# Altium project RTLS_Tag.PrjPcb
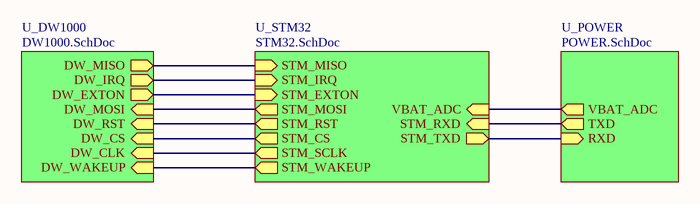
[diagram p0: TAG.SchDoc]
4 sheets, 76 parts. Net scope: hierarchical (ports join the sheet entries above them; power ports are global).
Board file: Tag_PCB.PcbDoc
Sheets:
  TAG.SchDoc
    U_DW1000 = DW1000.SchDoc
    U_POWER = POWER.SchDoc
    U_STM32 = STM32.SchDoc

## Sheet TAG.SchDoc
size A

### Sub-sheets
U_DW1000 = DW1000.SchDoc: DW_MOSI (in), DW_CS (in), DW_EXTON (out), DW_IRQ (out), DW_RST (in), DW_CLK (in), DW_MISO (out), DW_WAKEUP (in)
U_POWER = POWER.SchDoc: VBAT_ADC (out), TXD (out), RXD (in)
U_STM32 = STM32.SchDoc: STM_CS (out), STM_SCLK (out), STM_MISO (in), STM_MOSI (out), STM_WAKEUP (out), STM_IRQ (in), STM_EXTON (in), STM_RST (out), STM_TXD (out), STM_RXD (in), VBAT_ADC (in)

### Nets
DW_NRST: sheet U_DW1000/DW_RST, sheet U_STM32/STM_RST
EXTON: sheet U_DW1000/DW_EXTON, sheet U_STM32/STM_EXTON
IRQ: sheet U_DW1000/DW_IRQ, sheet U_STM32/STM_IRQ
SPI1_CLK: sheet U_DW1000/DW_CLK, sheet U_STM32/STM_SCLK
SPI1_CS: sheet U_DW1000/DW_CS, sheet U_STM32/STM_CS
SPI1_MISO: sheet U_DW1000/DW_MISO, sheet U_STM32/STM_MISO
SPI1_MOSI: sheet U_DW1000/DW_MOSI, sheet U_STM32/STM_MOSI
UART1_RXD: sheet U_POWER/RXD, sheet U_STM32/STM_TXD
UART1_TXD: sheet U_POWER/TXD, sheet U_STM32/STM_RXD
VBAT_ADC: sheet U_POWER/VBAT_ADC, sheet U_STM32/VBAT_ADC
WAKEUP: sheet U_DW1000/DW_WAKEUP, sheet U_STM32/STM_WAKEUP

## Sheet DW1000.SchDoc
size A
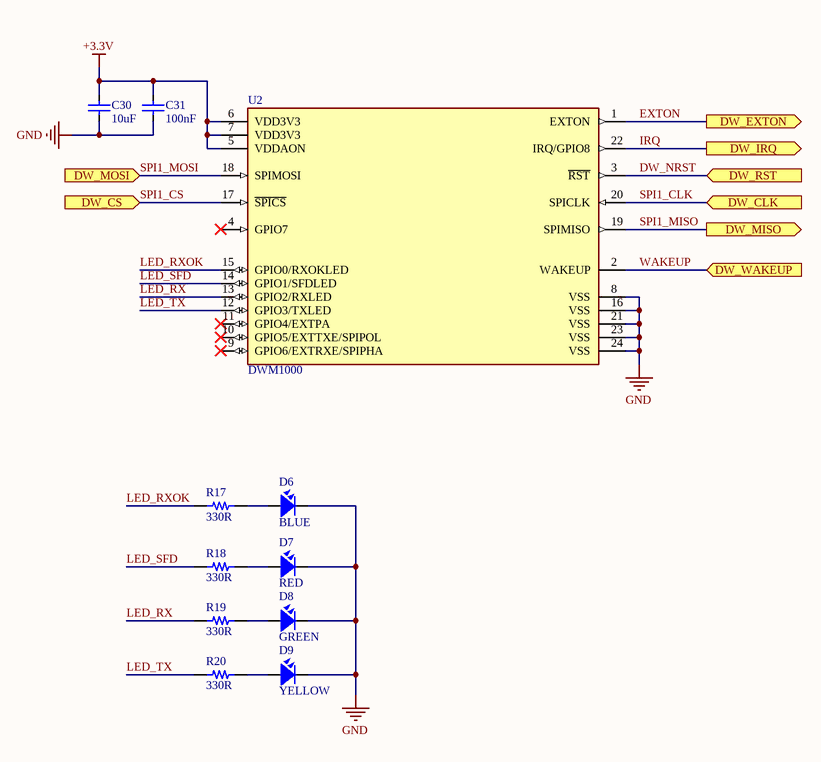
[diagram p1: DW1000.SchDoc]

### Parts
C30  10uF  [CAP_0603]
C31  100nF  [CAP_0603]
D6  BLUE  [LED-0603-Green]
D7  RED  [LED-0603-Red]
D8  GREEN  [LED-0603-Green]
D9  YELLOW  [LED-0603-Green]
R17  330R  [RES-SMD-0603]
R18  330R  [RES-SMD-0603]
R19  330R  [RES-SMD-0603]
R20  330R  [RES-SMD-0603]
U2  DWM1000  [DW1000]

### Ports
DW_CLK (in), DW_CS (in), DW_EXTON (out), DW_IRQ (out), DW_MISO (out), DW_MOSI (in), DW_RST (in), DW_WAKEUP (in)

### Nets
+3.3V: C30.2 C31.2 U2.5(VDDAON) U2.6(VDD3V3) U2.7(VDD3V3)
GND: C30.1 C31.1 D6.2 D7.2 D8.2 D9.2 U2.8(VSS) U2.16(VSS) U2.21(VSS) U2.23(VSS) U2.24(VSS)
DW_NRST: U2.3(~{RST}) ; port DW_RST
EXTON: U2.1(EXTON) ; port DW_EXTON
IRQ: U2.22(IRQ/GPIO8) ; port DW_IRQ
LED_RX: R19.2 U2.13(GPIO2/RXLED)
LED_RXOK: R17.2 U2.15(GPIO0/RXOKLED)
LED_SFD: R18.2 U2.14(GPIO1/SFDLED)
LED_TX: R20.2 U2.12(GPIO3/TXLED)
SPI1_CLK: U2.20(SPICLK) ; port DW_CLK
SPI1_CS: U2.17(~{SPICS}) ; port DW_CS
SPI1_MISO: U2.19(SPIMISO) ; port DW_MISO
SPI1_MOSI: U2.18(SPIMOSI) ; port DW_MOSI
WAKEUP: U2.2(WAKEUP) ; port DW_WAKEUP
NetD6_1: D6.1 R17.1
NetD7_1: D7.1 R18.1
NetD8_1: D8.1 R19.1
NetD9_1: D9.1 R20.1

Not connected (* = marked no-connect by the designer): U2 4(GPIO7)* 9(GPIO6/EXTRXE/SPIPHA)* 10(GPIO5/EXTTXE/SPIPOL)* 11(GPIO4/EXTPA)*

### Library data of the parts
C30 C31 = CapSMD: Capacitor; Value: 33p; Published: 8-Jun-2000; LatestRevisionDate: 17-Jul-2002; LatestRevisionNote: Re-released for DXP Platform.; PackageReference: RAD-0.3; Publisher: Altium Limited
D6-D9 = LED: LED Single colour Green and Red; Value: LED 3 ly Single Colour
R17-R20 = Resistor - SMD: Resistor; Manufacturer: Generic Components; Class: Passive; Published: 08/06/2000; Publisher: Altium Hobart Technology Centre
U2 = DWM1000: Decawave's DW1000 Ultra / Wideband (UWB) transceiver IC

## Sheet POWER.SchDoc
size A4
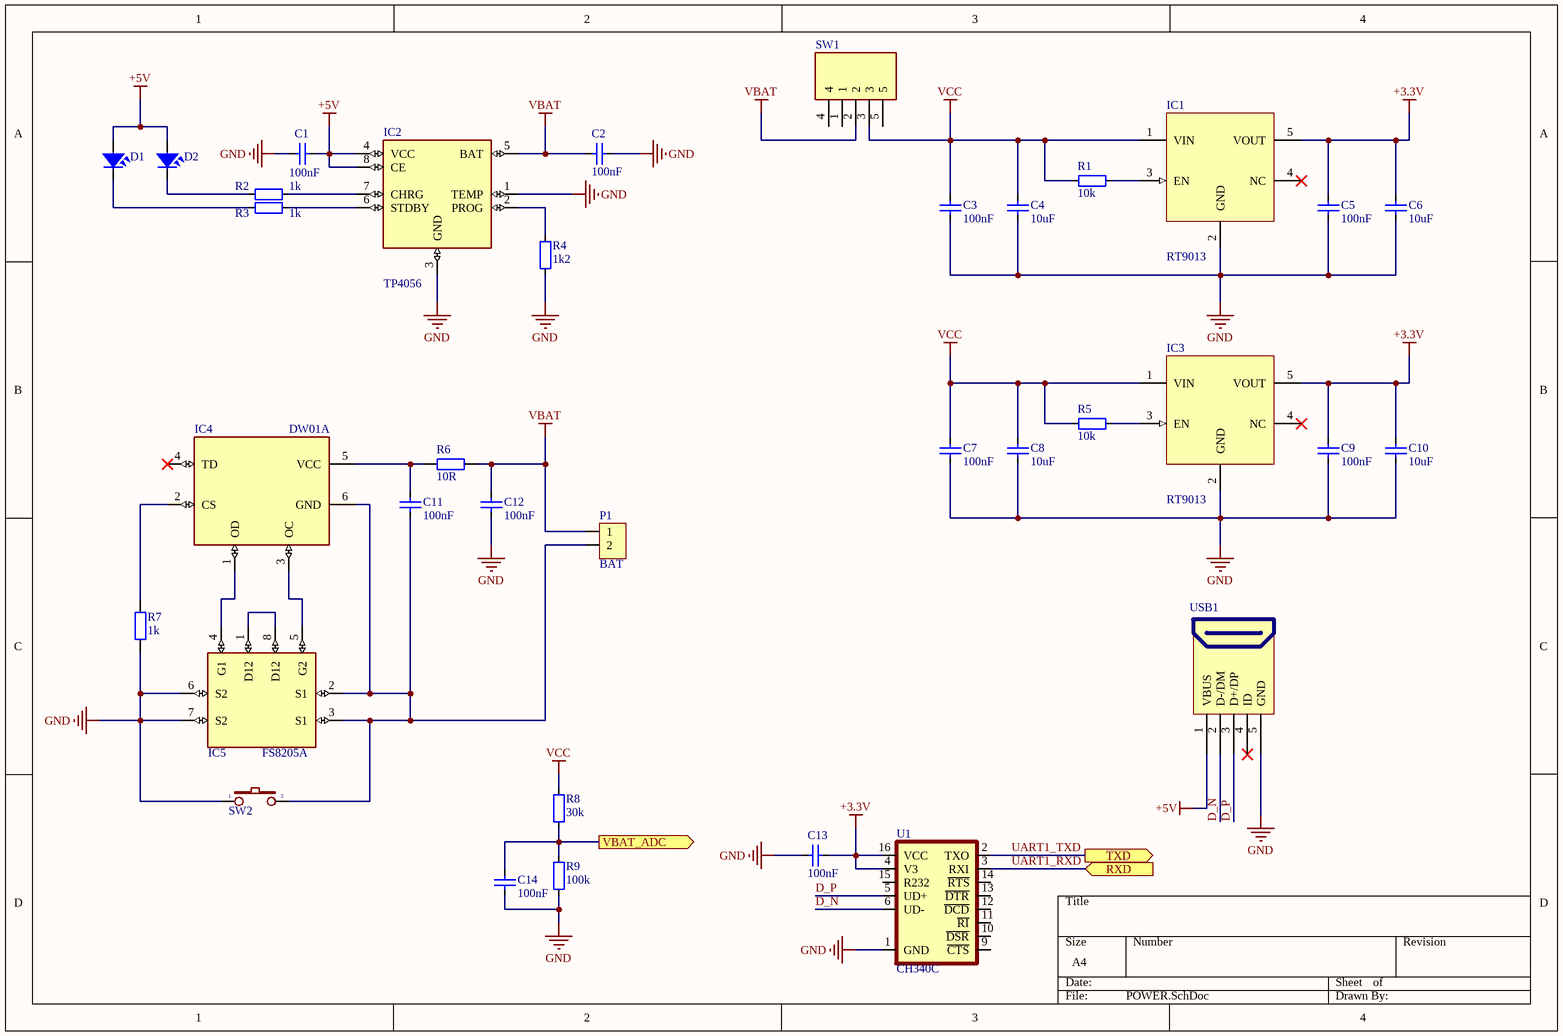
[diagram p2: POWER.SchDoc]

### Parts
C1  100nF  [CAP_0603]
C2  100nF  [CAP_0603]
C3  100nF  [CAP_0603]
C4  10uF  [CAP_0603]
C5  100nF  [CAP_0603]
C6  10uF  [CAP_0603]
C7  100nF  [CAP_0603]
C8  10uF  [CAP_0603]
C9  100nF  [CAP_0603]
C10  10uF  [CAP_0603]
C11  100nF  [CAP_0603]
C12  100nF  [CAP_0603]
C13  100nF  [CAP_0603]
C14  100nF  [CAP_0603]
D1  BLUE  [LED-0603-Green]  (value not drawn)
D2  BLUE  [LED-0603-Green]  (value not drawn)
IC1  RT9013  [SOT23-5]
IC2  TP4056  [TP4056]
IC3  RT9013  [SOT23-5]
IC4  DW01A  [SOT23-6]
IC5  FS8205A  [FS8205A]
P1  BAT  [HEAD2P-1.25]
R1  10k  [RES-SMD-0603]
R2  1k  [RES-SMD-0603]
R3  1k  [RES-SMD-0603]
R4  1k2  [RES-SMD-0603]
R5  10k  [RES-SMD-0603]
R6  10R  [RES-SMD-0603]
R7  1k  [RES-SMD-0603]
R8  30k  [RES-SMD-0603]
R9  100k  [RES-SMD-0603]
SW1  Cong tac gat  [CONG-TAC-GAT]  (value not drawn)
SW2  SW  [SW]  (value not drawn)
U1  CH340C  [SO16]
USB1  USB Micro 5p DIP  [USB Micro 5p DIP]  (value not drawn)

### Ports
RXD (in), TXD (out), VBAT_ADC (out)

### Nets
+3.3V: C5.1 C6.1 C9.1 C10.1 C13.1 IC1.5(VOUT) IC3.5(VOUT) U1.4(V3) U1.16(VCC)
+5V: C1.1 D1.1 D2.1 IC2.4(VCC) IC2.8(CE) USB1.1(VBUS)
GND: C1.2 C2.1 C3.2 C4.2 C5.2 C6.2 C7.2 C8.2 C9.2 C10.2 C12.1 C13.2 C14.1 IC1.2(GND) IC2.1(TEMP) IC2.3(GND) IC3.2(GND) IC5.6(S2) IC5.7(S2) R4.1 R7.2 R9.2 SW2.1 U1.1(GND) USB1.5(GND)
VBAT: C2.2 C12.2 IC2.5(BAT) P1.1 R6.2 SW1.2
VCC: C3.1 C4.1 C7.1 C8.1 IC1.1(VIN) IC3.1(VIN) R1.2 R5.2 R8.1 SW1.3
D_N: U1.6(UD-) USB1.2(D-/DM)
D_P: U1.5(UD+) USB1.3(D+/DP)
UART1_RXD: U1.3(RXI) ; port RXD
UART1_TXD: U1.2(TXO) ; port TXD
VBAT_ADC: C14.2 R8.2 R9.1 ; port VBAT_ADC
NetC11_1: C11.1 IC4.6(GND) IC5.2(S1) IC5.3(S1) P1.2 SW2.2
NetC11_2: C11.2 IC4.5(VCC) R6.1
NetD1_2: D1.2 R3.2
NetD2_2: D2.2 R2.2
NetIC1_3: IC1.3(EN) R1.1
NetIC2_2: IC2.2(PROG) R4.2
NetIC2_6: IC2.6(STDBY) R3.1
NetIC2_7: IC2.7(CHRG) R2.1
NetIC3_3: IC3.3(EN) R5.1
NetIC4_1: IC4.1(OD) IC5.4(G1)
NetIC4_2: IC4.2(CS) R7.1
NetIC4_3: IC4.3(OC) IC5.5(G2)
NetIC5_1: IC5.1(D12) IC5.8(D12)

Not connected (* = marked no-connect by the designer): IC1 4(NC)*; IC3 4(NC)*; IC4 4(TD)*; SW1 1 4 5; U1 9(~{CTS}) 10(~{DSR}) 11(~{RI}) 12(~{DCD}) 13(~{DTR}) 14(~{RTS}) 15(R232); USB1 4(ID)*

### Library data of the parts
C1-C14 = CapSMD: Capacitor; Value: 33p; Published: 8-Jun-2000; LatestRevisionDate: 17-Jul-2002; LatestRevisionNote: Re-released for DXP Platform.; PackageReference: RAD-0.3; Publisher: Altium Limited
D1 D2 = LED: as D6 on sheet DW1000
IC1 IC3 = RT9013: RT9013-33GB IC REG LINEAR 3.3V 500mA SOT23-5
IC2 = TP4056: Complete single cell Li-Ion battery with a constant current / constant voltage linear charger
IC4 = DW01A: One Cell Lithium-ion/Polymer Battery Protection IC
P1 = Header2: Header IDC, 2 x 1 Pin Vertical 2.54mm Pitch (Non-Boxed, Male); Manufacturer: W¨¹rth Elektronik eiSos GmbH; partNo: 613002143121; ComponentLink1 Description: Manufacturer; ComponentLink2 Description: Datasheet; NoPins: 02; Created Date: 29 March 2013; ComponentLink1URL: http://www.we-online.com; ComponentLink2URL: http://katalog.we-online.de/em/datasheet/6130xx143121.pdf; Created by: Karrer Zheng
R1-R5 R8 R9 = Resistor - SMD: as R17 on sheet DW1000; Published: 08/06/2000; Publisher: Altium Hobart Technology Centre
R6 R7 = Resistor - SMD: Resistor SMD; Manufacturer: Generic Components; Class: Passive; Published: 08/06/2000; Publisher: Altium Hobart Technology Centre
U1 = CH340C: USB to serial chip CH340; MF: WCH; Package: Package; Check_prices: https://www.snapeda.com/parts/CH340C/WCH/view-part/5428851/?ref=eda; Value: *; Price: None; MP: CH340C; Availability: Unavailable; SnapEDA_Link: https://www.snapeda.com/parts/CH340C/WCH/view-part/5428851/?ref=snap
USB1 = USB Micro 5p DIP: USB Type B; Ten: MicroUSB MK5P DIP; Ma_Hang: MH005145

## Sheet STM32.SchDoc
size A4
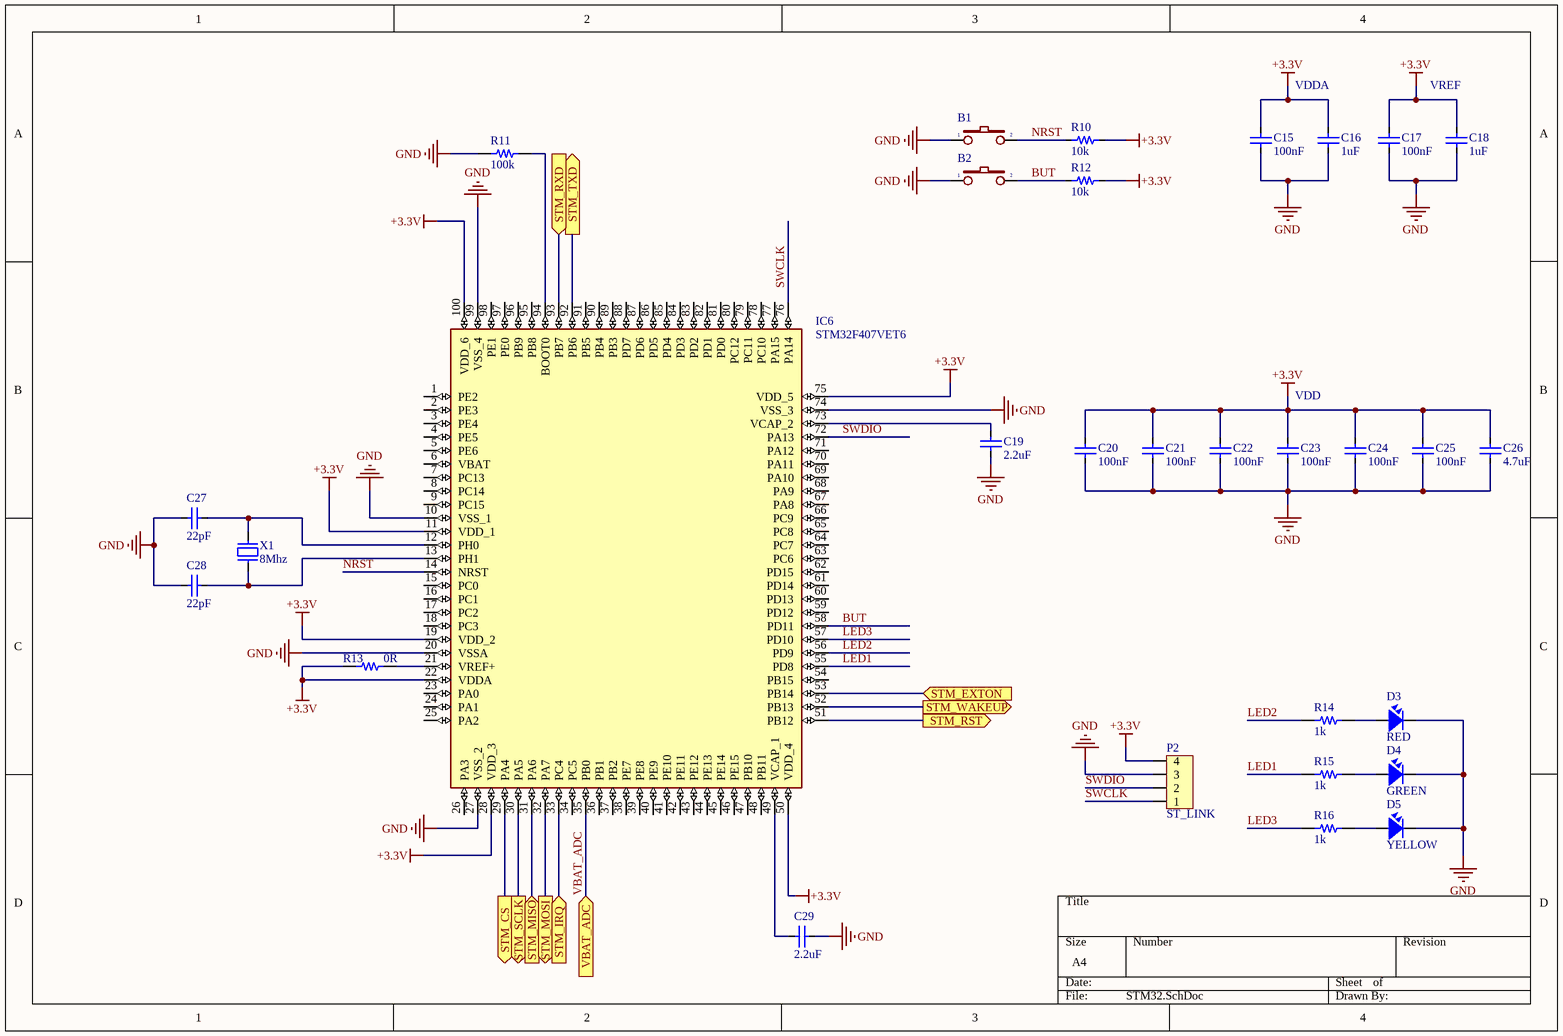
[diagram p3: STM32.SchDoc]

### Parts
B1  Button 3x4x2.5  [Button 3x4x2.5]  (value not drawn)
B2  Button 3x4x2.5  [BUTTON NGHIENG]  (value not drawn)
C15  100nF  [CAP_0603]
C16  1uF  [CAP_0603]
C17  100nF  [CAP_0603]
C18  1uF  [CAP_0603]
C19  2.2uF  [CAP_0603]
C20  100nF  [CAP_0603]
C21  100nF  [CAP_0603]
C22  100nF  [CAP_0603]
C23  100nF  [CAP_0603]
C24  100nF  [CAP_0603]
C25  100nF  [CAP_0603]
C26  4.7uF  [CAP_0603]
C27  22pF  [CAP_0603]
C28  22pF  [CAP_0603]
C29  2.2uF  [CAP_0603]
D3  RED  [LED-0603-Red]
D4  GREEN  [LED-0603-Green]
D5  YELLOW  [LED-0603-Red]
IC6  STM32F407VET6  [STM32F407VET6]
P2  ST_LINK  [HEADER4P-1.25]
R10  10k  [RES-SMD-0603]
R11  100k  [RES-SMD-0603]
R12  10k  [RES-SMD-0603]
R13  0R  [RES-SMD-0603]
R14  1k  [RES-SMD-0603]
R15  1k  [RES-SMD-0603]
R16  1k  [RES-SMD-0603]
X1  8Mhz  [XTAL 5032 SMD]

### Ports
STM_CS (out), STM_EXTON (in), STM_IRQ (in), STM_MISO (in), STM_MOSI (out), STM_RST (out), STM_RXD (in), STM_SCLK (out), STM_TXD (out), STM_WAKEUP (out), VBAT_ADC (in)

### Nets
+3.3V: C15.2 C16.2 C17.2 C18.2 C20.2 C21.2 C22.2 C23.2 C24.2 C25.2 C26.2 IC6.11(VDD_1) IC6.19(VDD_2) IC6.22(VDDA) IC6.28(VDD_3) IC6.50(VDD_4) IC6.75(VDD_5) IC6.100(VDD_6) P2.4 R10.1 R12.1 R13.2
GND: B1.1 B2.1 C15.1 C16.1 C17.1 C18.1 C19.2 C20.1 C21.1 C22.1 C23.1 C24.1 C25.1 C26.1 C27.1 C28.1 C29.2 D3.2 D4.2 D5.2 IC6.10(VSS_1) IC6.20(VSSA) IC6.27(VSS_2) IC6.74(VSS_3) IC6.99(VSS_4) P2.3 R11.1
BUT: B2.2 IC6.58(PD11) R12.2
DW_NRST: IC6.51(PB12) ; port STM_RST
EXTON: IC6.53(PB14) ; port STM_EXTON
IRQ: IC6.33(PC4) ; port STM_IRQ
LED1: IC6.55(PD8) R15.2
LED2: IC6.56(PD9) R14.2
LED3: IC6.57(PD10) R16.2
NRST: B1.2 IC6.14(NRST) R10.2
SPI1_CLK: IC6.30(PA5) ; port STM_SCLK
SPI1_CS: IC6.29(PA4) ; port STM_CS
SPI1_MISO: IC6.31(PA6) ; port STM_MISO
SPI1_MOSI: IC6.32(PA7) ; port STM_MOSI
SWCLK: IC6.76(PA14) P2.1
SWDIO: IC6.72(PA13) P2.2
UART1_RXD: IC6.92(PB6) ; port STM_TXD
UART1_TXD: IC6.93(PB7) ; port STM_RXD
VBAT_ADC: IC6.35(PB0) ; port VBAT_ADC
WAKEUP: IC6.52(PB13) ; port STM_WAKEUP
NetC19_1: C19.1 IC6.73(VCAP_2)
NetC27_2: C27.2 IC6.12(PH0) X1.1
NetC28_2: C28.2 IC6.13(PH1) X1.2
NetC29_1: C29.1 IC6.49(VCAP_1)
NetD3_1: D3.1 R14.1
NetD4_1: D4.1 R15.1
NetD5_1: D5.1 R16.1
NetIC6_21: IC6.21(VREF+) R13.1
NetIC6_94: IC6.94(BOOT0) R11.2

Not connected (* = marked no-connect by the designer): IC6 1(PE2) 2(PE3) 3(PE4) 4(PE5) 5(PE6) 6(VBAT) 7(PC13) 8(PC14) 9(PC15) 15(PC0) 16(PC1) 17(PC2) 18(PC3) 23(PA0) 24(PA1) 25(PA2) 26(PA3) 34(PC5) 36(PB1) 37(PB2) 38(PE7) 39(PE8) 40(PE9) 41(PE10) 42(PE11) 43(PE12) 44(PE13) 45(PE14) 46(PE15) 47(PB10) 48(PB11) 54(PB15) 59(PD12) 60(PD13) 61(PD14) 62(PD15) 63(PC6) 64(PC7) 65(PC8) 66(PC9) 67(PA8) 68(PA9) 69(PA10) 70(PA11) 71(PA12) 77(PA15) 78(PC10) 79(PC11) 80(PC12) 81(PD0) 82(PD1) 83(PD2) 84(PD3) 85(PD4) 86(PD5) 87(PD6) 88(PD7) 89(PB3) 90(PB4) 91(PB5) 95(PB8) 96(PB9) 97(PE0) 98(PE1)

### Notes on the sheet
- VDDA
- VREF
- VDD

### Library data of the parts
C15-C29 = CapSMD: Capacitor; Value: 33p; Published: 8-Jun-2000; LatestRevisionDate: 17-Jul-2002; LatestRevisionNote: Re-released for DXP Platform.; PackageReference: RAD-0.3; Publisher: Altium Limited
D3-D5 = LED: as D6 on sheet DW1000
P2 = Header4: Header IDC, 4 x 1 Pin Vertical 2.54mm Pitch (Non-Boxed, Male); Manufacturer: W¨¹rth Elektronik eiSos GmbH; partNo: 613002143121; ComponentLink1 Description: Manufacturer; ComponentLink2 Description: Datasheet; NoPins: 02; Created Date: 29 March 2013; ComponentLink1URL: http://www.we-online.com; ComponentLink2URL: http://katalog.we-online.de/em/datasheet/6130xx143121.pdf; Created by: Karrer Zheng
R10-R16 = Resistor - SMD: as R17 on sheet DW1000; Published: 08/06/2000; Publisher: Altium Hobart Technology Centre
X1 = XT2: Crystal For all Crystal 2pin.; Value: 4Mhz

## Nets that join several sheets
+3.3V: DW1000 (5 pins), POWER (9 pins), STM32 (22 pins)
GND: DW1000 (11 pins), POWER (25 pins), STM32 (27 pins)
DW_NRST: DW1000 (U2.3), STM32 (IC6.51)
EXTON: DW1000 (U2.1), STM32 (IC6.53)
IRQ: DW1000 (U2.22), STM32 (IC6.33)
SPI1_CLK: DW1000 (U2.20), STM32 (IC6.30)
SPI1_CS: DW1000 (U2.17), STM32 (IC6.29)
SPI1_MISO: DW1000 (U2.19), STM32 (IC6.31)
SPI1_MOSI: DW1000 (U2.18), STM32 (IC6.32)
UART1_RXD: POWER (U1.3), STM32 (IC6.92)
UART1_TXD: POWER (U1.2), STM32 (IC6.93)
VBAT_ADC: POWER (C14.2 R8.2 R9.1), STM32 (IC6.35)
WAKEUP: DW1000 (U2.2), STM32 (IC6.52)